# Altium schematic sheet Button.SchDoc
size A4; SheetNumber: 7; SheetTotal: 11
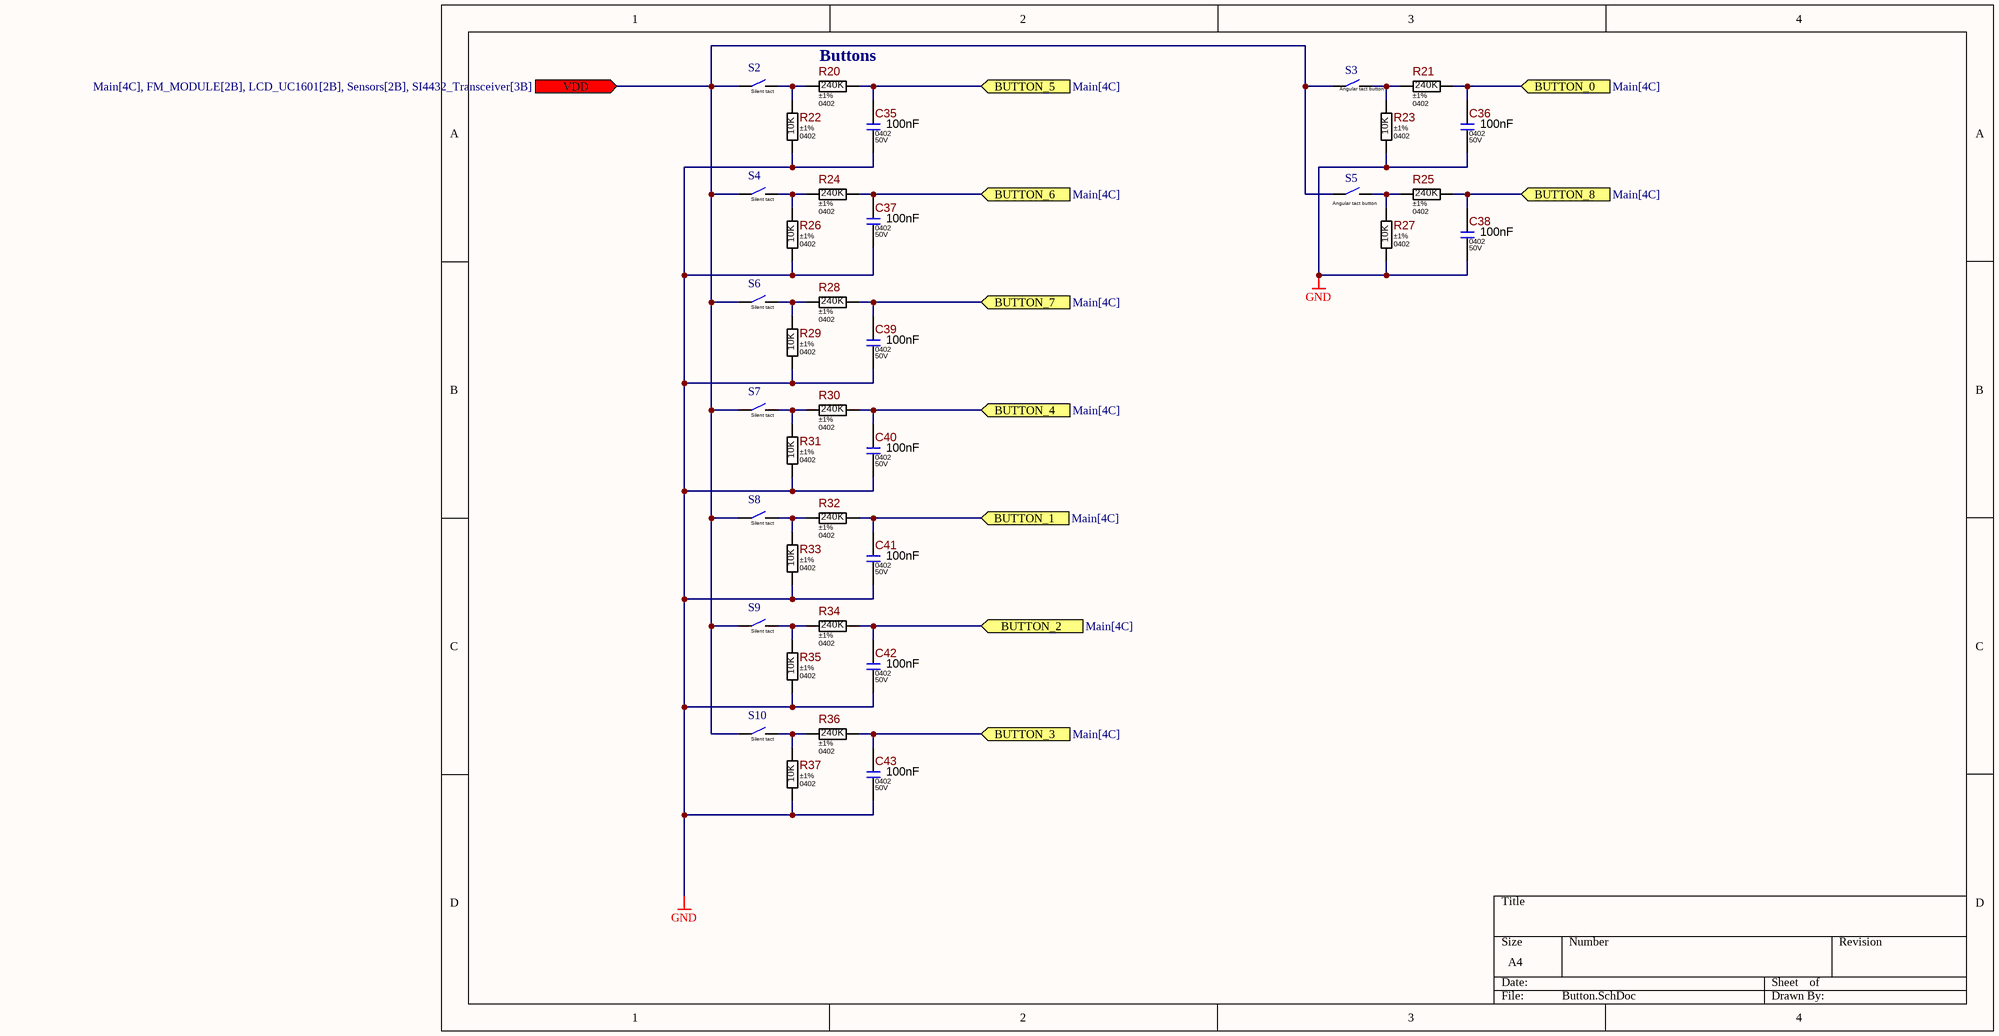
[diagram p0: Button.SchDoc]

## Parts
C35  Package: 0402  Voltage: 50V  [Cap_0402]  (hidden comment: 100nF)
C36  Package: 0402  Voltage: 50V  [Cap_0402]  (hidden comment: 100nF)
C37  Package: 0402  Voltage: 50V  [Cap_0402]  (hidden comment: 100nF)
C38  Package: 0402  Voltage: 50V  [Cap_0402]  (hidden comment: 100nF)
C39  Package: 0402  Voltage: 50V  [Cap_0402]  (hidden comment: 100nF)
C40  Package: 0402  Voltage: 50V  [Cap_0402]  (hidden comment: 100nF)
C41  Package: 0402  Voltage: 50V  [Cap_0402]  (hidden comment: 100nF)
C42  Package: 0402  Voltage: 50V  [Cap_0402]  (hidden comment: 100nF)
C43  Package: 0402  Voltage: 50V  [Cap_0402]  (hidden comment: 100nF)
R20  value 240K  Tolerance: ±1%  Package: 0402  [Res_0402]  (hidden comment: Res_0402_240K)
R21  value 240K  Tolerance: ±1%  Package: 0402  [Res_0402]  (hidden comment: Res_0402_240K)
R22  value 10K  Tolerance: ±1%  Package: 0402  [Res_0402]  (hidden comment: Res_0402_10K)
R23  value 10K  Tolerance: ±1%  Package: 0402  [Res_0402]  (hidden comment: Res_0402_10K)
R24  value 240K  Tolerance: ±1%  Package: 0402  [Res_0402]  (hidden comment: Res_0402_240K)
R25  value 240K  Tolerance: ±1%  Package: 0402  [Res_0402]  (hidden comment: Res_0402_240K)
R26  value 10K  Tolerance: ±1%  Package: 0402  [Res_0402]  (hidden comment: Res_0402_10K)
R27  value 10K  Tolerance: ±1%  Package: 0402  [Res_0402]  (hidden comment: Res_0402_10K)
R28  value 240K  Tolerance: ±1%  Package: 0402  [Res_0402]  (hidden comment: Res_0402_240K)
R29  value 10K  Tolerance: ±1%  Package: 0402  [Res_0402]  (hidden comment: Res_0402_10K)
R30  value 240K  Tolerance: ±1%  Package: 0402  [Res_0402]  (hidden comment: Res_0402_240K)
R31  value 10K  Tolerance: ±1%  Package: 0402  [Res_0402]  (hidden comment: Res_0402_10K)
R32  value 240K  Tolerance: ±1%  Package: 0402  [Res_0402]  (hidden comment: Res_0402_240K)
R33  value 10K  Tolerance: ±1%  Package: 0402  [Res_0402]  (hidden comment: Res_0402_10K)
R34  value 240K  Tolerance: ±1%  Package: 0402  [Res_0402]  (hidden comment: Res_0402_240K)
R35  value 10K  Tolerance: ±1%  Package: 0402  [Res_0402]  (hidden comment: Res_0402_10K)
R36  value 240K  Tolerance: ±1%  Package: 0402  [Res_0402]  (hidden comment: Res_0402_240K)
R37  value 10K  Tolerance: ±1%  Package: 0402  [Res_0402]  (hidden comment: Res_0402_10K)
S2  Name: Silent tact  [Tact Switch_6*6*5mm]  (hidden comment: Silent Tact Switch)
S3  Angular tact button  [Tact_button_3X6X3.5mm]
S4  Name: Silent tact  [Tact Switch_6*6*5mm]  (hidden comment: Silent Tact Switch)
S5  Angular tact button  [Tact_button_3X6X3.5mm]
S6  Name: Silent tact  [Tact Switch_6*6*5mm]  (hidden comment: Silent Tact Switch)
S7  Name: Silent tact  [Tact Switch_6*6*5mm]  (hidden comment: Silent Tact Switch)
S8  Name: Silent tact  [Tact Switch_6*6*5mm]  (hidden comment: Silent Tact Switch)
S9  Name: Silent tact  [Tact Switch_6*6*5mm]  (hidden comment: Silent Tact Switch)
S10  Name: Silent tact  [Tact Switch_6*6*5mm]  (hidden comment: Silent Tact Switch)

## Ports
BUTTON_0 (in, see Main[4C]), BUTTON_1 (in, see Main[4C]), BUTTON_2 (in, see Main[4C]), BUTTON_3 (in, see Main[4C]), BUTTON_4 (in, see Main[4C]), BUTTON_5 (in, see Main[4C]), BUTTON_6 (in, see Main[4C]), BUTTON_7 (in, see Main[4C]), BUTTON_8 (in, see Main[4C]), VDD (in, see Main[4C], FM_MODULE[2B], LCD_UC1601[2B], Sensors[2B], SI4432_Transceiver[3B])

## Nets
GND: C35.2 C36.2 C37.2 C38.2 C39.2 C40.2 C41.2 C42.2 C43.2 R22.2 R23.2 R26.2 R27.2 R29.2 R31.2 R33.2 R35.2 R37.2
BUTTON_0: C36.1 R21.2 ; port BUTTON_0
BUTTON_1: C41.1 R32.2 ; port BUTTON_1
BUTTON_2: C42.1 R34.2 ; port BUTTON_2
BUTTON_3: C43.1 R36.2 ; port BUTTON_3
BUTTON_4: C40.1 R30.2 ; port BUTTON_4
BUTTON_5: C35.1 R20.2 ; port BUTTON_5
BUTTON_6: C37.1 R24.2 ; port BUTTON_6
BUTTON_7: C39.1 R28.2 ; port BUTTON_7
BUTTON_8: C38.1 R25.2 ; port BUTTON_8
VDD: S2.1 S3.1 S4.1 S5.1 S6.1 S7.1 S8.1 S9.1 S10.1 ; port VDD
NetR20_1: R20.1 R22.1 S2.2
NetR21_1: R21.1 R23.1 S3.2
NetR24_1: R24.1 R26.1 S4.2
NetR25_1: R25.1 R27.1 S5.2
NetR28_1: R28.1 R29.1 S6.2
NetR30_1: R30.1 R31.1 S7.2
NetR32_1: R32.1 R33.1 S8.2
NetR34_1: R34.1 R35.1 S9.2
NetR36_1: R36.1 R37.1 S10.2

## Notes on the sheet
- (near R20) Buttons

## Library data of the parts
C35-C43 = Cap_0402_100nF: 100nF 50V  ±25% 0402 Ceramic Capacitor; Component Type: SMD; Tolerance: ±25%; ComponentLink1URL: https://search.murata.co.jp/Ceramy/image/img/A01X/G101/ENG/GRM31CR60J107ME39-01.pdf; ComponentLink1Description: Datasheet; Value: 100nF
R20 R21 R24 R25 R28 R30 R32 R34 R36 = Res_0402_240K: ±1% 1/16W 0402; Power Rating: 0.062W; Voltage: 50V; ComponentLink1URL: https://www.yageo.com/upload/media/product/productsearch/datasheet/rchip/PYu-RC_Group_51_RoHS_L_10.pdf; ComponentLink1Description: Datasheet
R22 R23 R26 R27 R29 R31 R33 R35 R37 = Res_0402_10K: ±1% 1/16W 0402; Power Rating: 0.062W; Voltage: 50V; ComponentLink1URL: https://www.yageo.com/upload/media/product/productsearch/datasheet/rchip/PYu-RC_Group_51_RoHS_L_10.pdf; ComponentLink1Description: Datasheet
S2 S4 S6-S10 = Silent Tact Switch: 6*6*5mm Smd Silicone Button Switch
S3 S5 = Angular tact button: 3X6X3.5mm; Name: Angular tact button